# EAGLE design main (EAGLE 9.5.1)
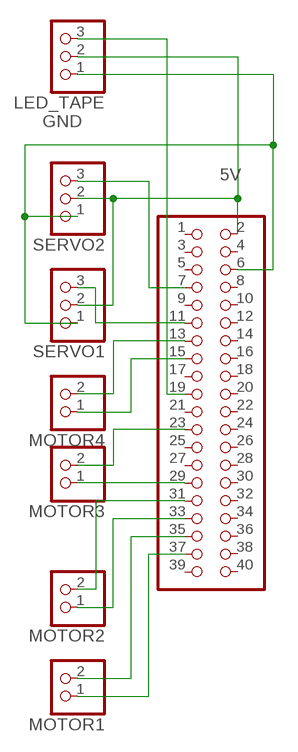
[diagram p0: schematic, sheet 1]

## Parts
JP  PINHD-2X20  [2X20]
LED_TAPE  PINHD-1X3  [1X03]
MOTOR1  PINHD-1X2  [1X02]
MOTOR2  PINHD-1X2  [1X02]
MOTOR3  PINHD-1X2  [1X02]
MOTOR4  PINHD-1X2  [1X02]
SERVO1  PINHD-1X3  [1X03]
SERVO2  PINHD-1X3  [1X03]

## Nets
5V: JP.2 LED_TAPE.2 SERVO1.2 SERVO2.2
GND: JP.6 LED_TAPE.1 SERVO1.1 SERVO2.1
N$1: JP.19 LED_TAPE.3
N$4: JP.37 MOTOR1.1
N$5: JP.35 MOTOR1.2
N$6: JP.33 MOTOR2.1
N$7: JP.31 MOTOR2.2
N$8: JP.29 MOTOR3.1
N$9: JP.23 MOTOR3.2
N$10: JP.13 MOTOR4.2
N$11: JP.15 MOTOR4.1
N$12: JP.7 SERVO2.3
N$13: JP.11 SERVO1.3
Unconnected: JP.1 JP.3 JP.4 JP.5 JP.8 JP.9 JP.10 JP.12 JP.14 JP.16 JP.17 JP.18 JP.20 JP.21 JP.22 JP.24 JP.25 JP.26 JP.27 JP.28 JP.30 JP.32 JP.34 JP.36 JP.38 JP.39 JP.40

## Library data of the parts
JP = pinhead:PINHD-2X20: PIN HEADER
LED_TAPE SERVO1 SERVO2 = pinhead:PINHD-1X3: PIN HEADER
MOTOR1-MOTOR4 = pinhead:PINHD-1X2: PIN HEADER

## Board
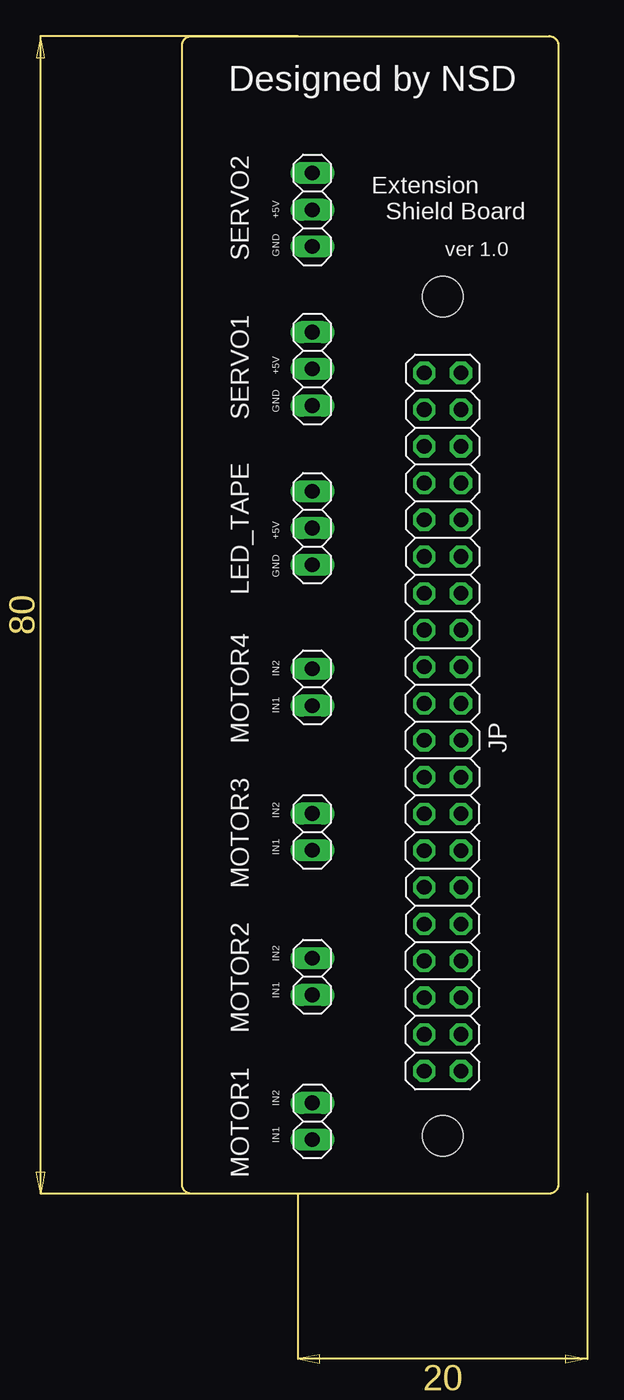
[diagram p1: board, top side]
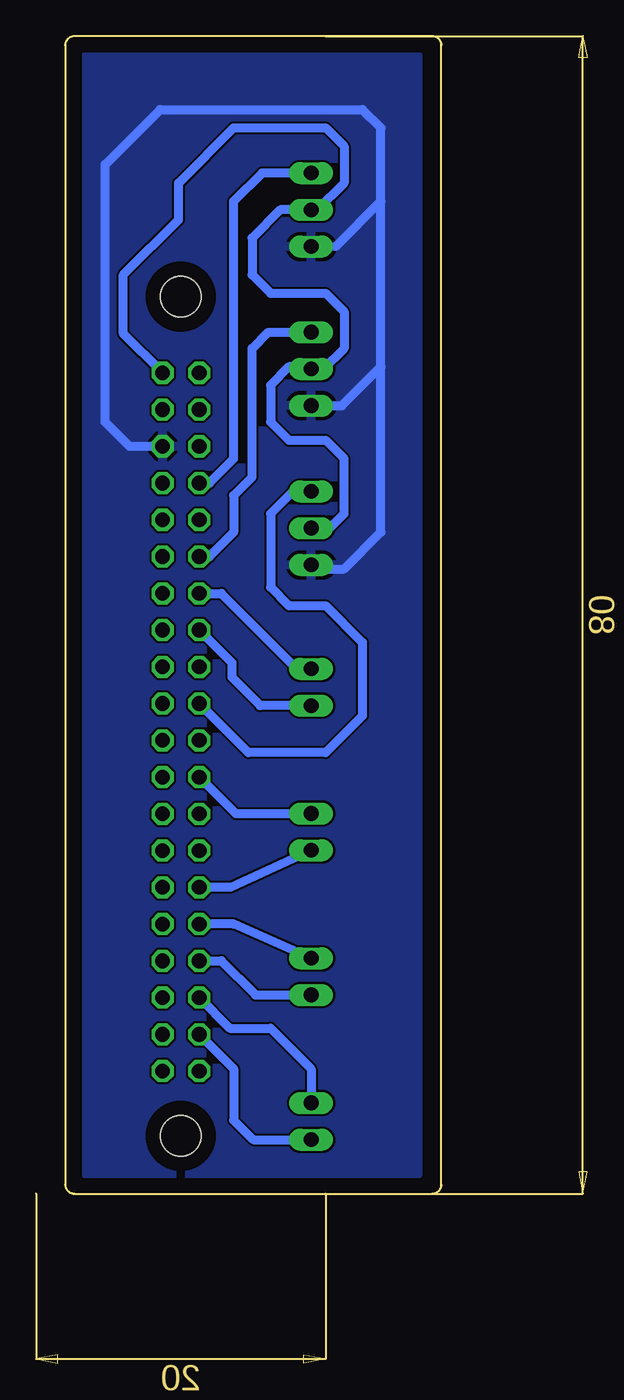
[diagram p2: board, bottom side, seen from below]

Size 26 x 80 mm. Coordinates in mm from the lower left corner, seen from the top.
Outline: 26,79.36 26,0.64 arc-90 25.36,0 0.63,0 arc-90 0,0.64 0,79.36 arc-90 0.63,80 25.36,80 arc-90 26,79.36
Copper layers (1*16): Top 0.035mm / dielectric 1.5mm / Bottom 0.035mm
Design rules "default": minimum track width 6mil, minimum drill 0.35mm, track to track 6mil, track to pad 6mil, pad to pad 6mil, via to via 6mil, smd to smd 6mil, copper to edge 40mil, drill to drill 6mil, minimum pad ring 10mil, minimum via ring 8mil, stop-mask expansion 4mil, vias tented up to drill 0mil, thermal gap 10mil
Holes 2.8 mm at 18,4 18,62

### Footprints (pad centres in the part's own frame; a part is rotated, then mirrored left to right if it is on the bottom)
2X20 = drill 1.016 octagon: 1 -24.13,-1.27; 2 -24.13,1.27; 3 -21.59,-1.27; 4 -21.59,1.27; 5 -19.05,-1.27; 6 -19.05,1.27; 7 -16.51,-1.27; 8 -16.51,1.27; 9 -13.97,-1.27; 10 -13.97,1.27; 11 -11.43,-1.27; 12 -11.43,1.27; 13 -8.89,-1.27; 14 -8.89,1.27; 15 -6.35,-1.27; 16 -6.35,1.27; 17 -3.81,-1.27; 18 -3.81,1.27; 19 -1.27,-1.27; 20 -1.27,1.27; 21 1.27,-1.27; 22 1.27,1.27; 23 3.81,-1.27; 24 3.81,1.27; 25 6.35,-1.27; 26 6.35,1.27; 27 8.89,-1.27; 28 8.89,1.27; 29 11.43,-1.27; 30 11.43,1.27; 31 13.97,-1.27; 32 13.97,1.27; 33 16.51,-1.27; 34 16.51,1.27; 35 19.05,-1.27; 36 19.05,1.27; 37 21.59,-1.27; 38 21.59,1.27; 39 24.13,-1.27; 40 24.13,1.27
1X03 = drill 1.016 long: 1 -2.54,0; 2 0,0; 3 2.54,0
1X02 = drill 1.016 long: 1 -1.27,0; 2 1.27,0

### Placement (x,y rotation side)
JP  18,32.6 270 top
LED_TAPE  9,46 90 top
MOTOR1  9,5 90 top
MOTOR2  9,15 90 top
MOTOR3  9,25 90 top
MOTOR4  9,35 90 top
SERVO1  9,57 90 top
SERVO2  9,68 90 top

### Tracks (layer width: path | path; a pad name or v marks a point on that pad's centre or on a via)
5V
  Bottom 0.61: JP.2 21.97,59.43 21.97,63.5 18.16,67.31 18.16,69.85 14.35,73.66 8,73.66 6.73,72.39 6.73,69.85 8.58,68 SERVO2.2 11.12,68 13.08,66.04 13.08,63.5 11.81,62.23 8,62.23 6.73,60.96 6.73,58.42 8.15,57 SERVO1.2 9.15,57.15 10.54,57.15 11.81,55.88 11.81,53.34 10.54,52.07 8,52.07 6.73,50.8 6.73,46.99 7.72,46 LED_TAPE.2
GND
  Bottom 0.61: JP.6 21.55,51.65 23.24,53.34 23.24,71.12 19.43,74.93 5.46,74.93 4.19,73.66 4.19,68.58 | 4.19,57.15 4.19,45.72 6.73,43.18 9.72,43.18 LED_TAPE.1 | 4.19,57.15 4.19,68.58 | 7.31,65.46 4.19,68.58 | SERVO1.1 6.88,54.46 4.19,57.15
  pour Bottom: 1.65,78.74 1.65,1.27 24.51,1.27 24.51,78.74
N$1
  Bottom 0.61: JP.19 13.34,30.48 8,30.48 5.46,33.02 5.46,38.1 8,40.64 10.54,40.64 11.81,41.91 11.81,46.99 10.26,48.54 LED_TAPE.3
N$4
  Bottom 0.61: JP.37 14.35,8.63 14.35,5.08 13,3.73 MOTOR1.1
N$5
  Bottom 0.61: JP.35 14.61,11.43 11.81,11.43 9,8.62 MOTOR1.2
N$6
  Bottom 0.61: JP.33 15.2,16.09 12.84,13.73 MOTOR2.1
N$7
  Bottom 0.61: MOTOR2.2 14.36,18.63 JP.31
N$8
  Bottom 0.61: MOTOR3.1 14.56,21.17 JP.29
N$9
  Bottom 0.61: JP.23 14.21,26.27 MOTOR3.2
N$10
  Bottom 0.61: JP.13 15.2,41.49 9.98,36.27 MOTOR4.2
N$11
  Bottom 0.61: MOTOR4.1 12.52,33.73 14.48,35.69 14.48,36.7 JP.15
N$12
  Bottom 0.61: SERVO2.3 12.39,70.54 14.35,68.58 14.35,50.8 16.04,49.11 JP.7
N$13
  Bottom 0.61: SERVO1.3 11.96,59.54 13.08,58.42 13.08,49.53 14.35,48.26 14.35,45.72 16.04,44.03 JP.11

### Text on the board
tNames: Designed by NSD | Extension / Shield Board | GND +5V | ver 1.0 | GND +5V | GND +5V | IN1 IN2 | IN1 IN2 | IN1 IN2 | IN1 IN2